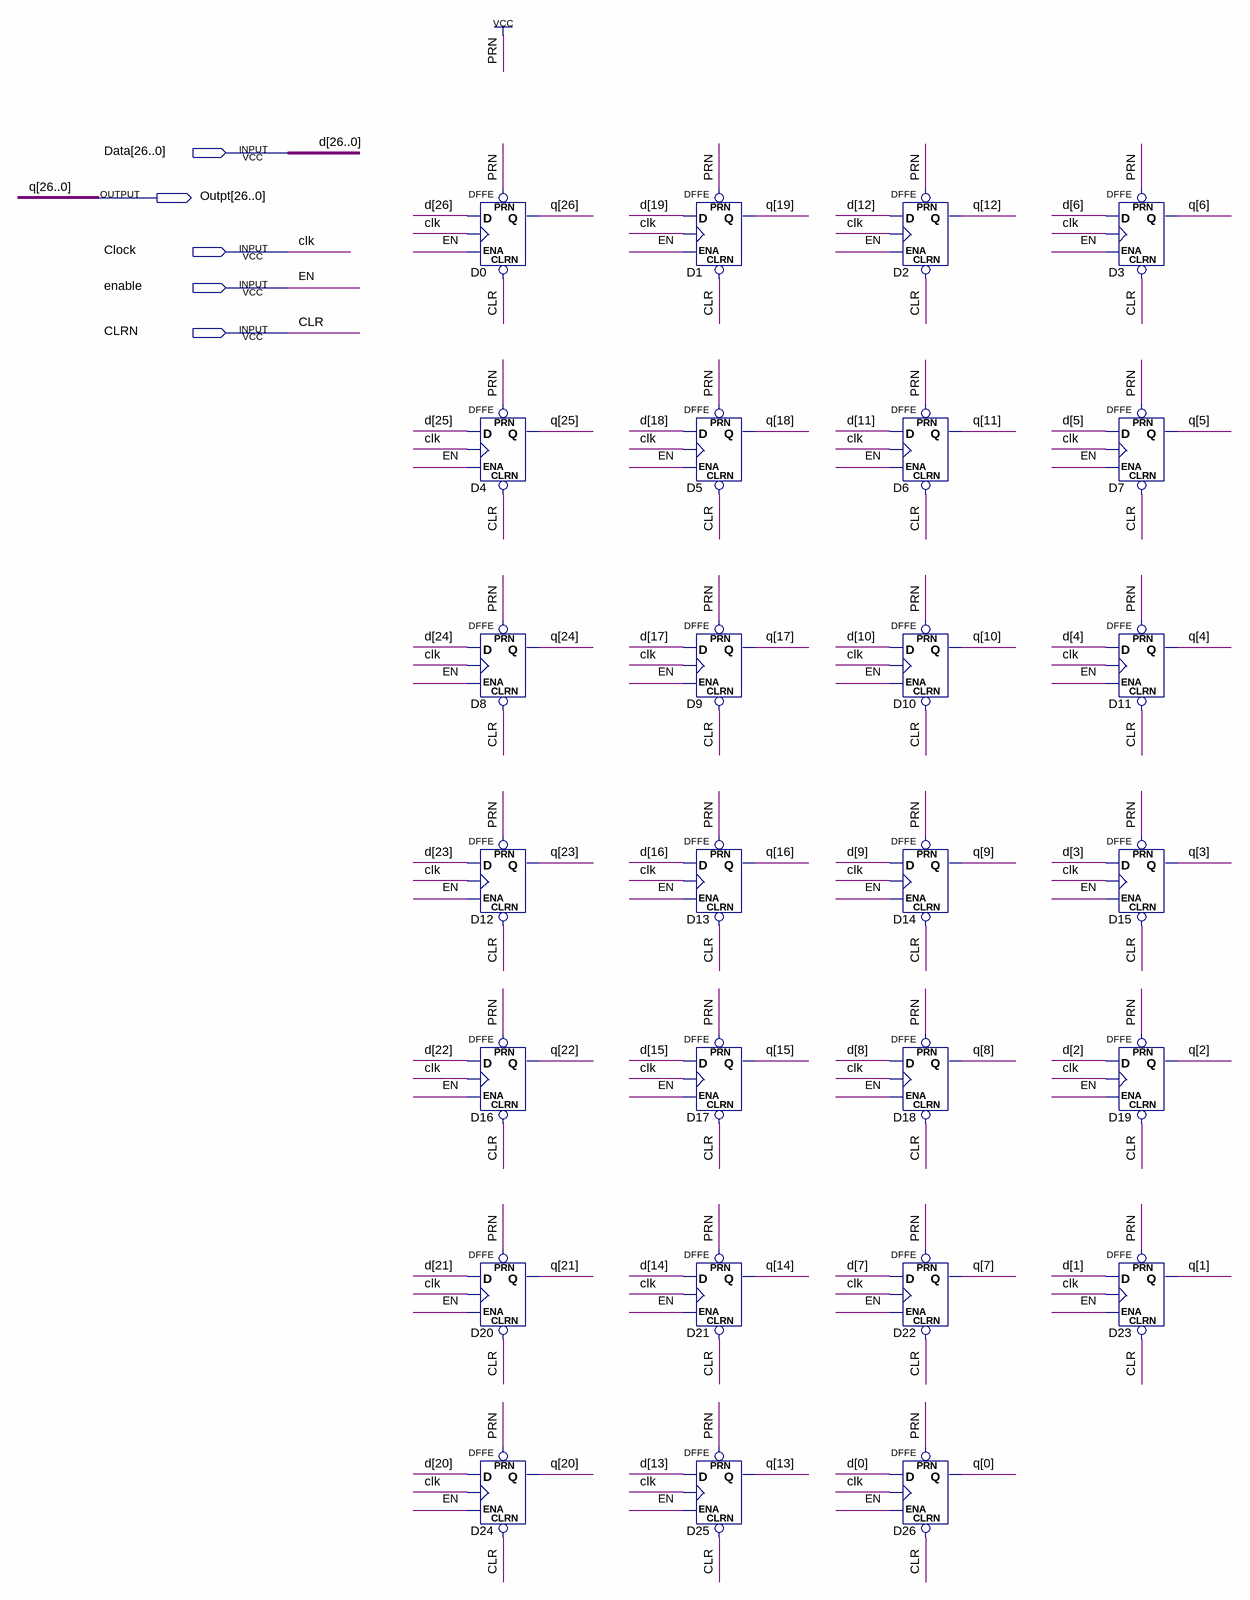
[diagram p0: schematic sheet]
// Quartus schematic twentysixbitreg.bdf as structural Verilog: 27 symbols, 5 pins
module twentysixbitreg (
  input  [26:0] Data,
  input  Clock,
  input  enable,
  input  CLRN,
  output [26:0] Outpt
);

  DFFE D0 (.PRN(1'b1), .CLRN(CLRN), .D(Data[26]), .CLK(Clock), .ENA(enable), .Q(Outpt[26]));
  DFFE D4 (.PRN(1'b1), .CLRN(CLRN), .D(Data[25]), .CLK(Clock), .ENA(enable), .Q(Outpt[25]));
  DFFE D8 (.PRN(1'b1), .CLRN(CLRN), .D(Data[24]), .CLK(Clock), .ENA(enable), .Q(Outpt[24]));
  DFFE D12 (.PRN(1'b1), .CLRN(CLRN), .D(Data[23]), .CLK(Clock), .ENA(enable), .Q(Outpt[23]));
  DFFE D16 (.PRN(1'b1), .CLRN(CLRN), .D(Data[22]), .CLK(Clock), .ENA(enable), .Q(Outpt[22]));
  DFFE D20 (.PRN(1'b1), .CLRN(CLRN), .D(Data[21]), .CLK(Clock), .ENA(enable), .Q(Outpt[21]));
  DFFE D24 (.PRN(1'b1), .CLRN(CLRN), .D(Data[20]), .CLK(Clock), .ENA(enable), .Q(Outpt[20]));
  DFFE D1 (.PRN(1'b1), .CLRN(CLRN), .D(Data[19]), .CLK(Clock), .ENA(enable), .Q(Outpt[19]));
  DFFE D5 (.PRN(1'b1), .CLRN(CLRN), .D(Data[18]), .CLK(Clock), .ENA(enable), .Q(Outpt[18]));
  DFFE D9 (.PRN(1'b1), .CLRN(CLRN), .D(Data[17]), .CLK(Clock), .ENA(enable), .Q(Outpt[17]));
  DFFE D13 (.PRN(1'b1), .CLRN(CLRN), .D(Data[16]), .CLK(Clock), .ENA(enable), .Q(Outpt[16]));
  DFFE D17 (.PRN(1'b1), .CLRN(CLRN), .D(Data[15]), .CLK(Clock), .ENA(enable), .Q(Outpt[15]));
  DFFE D21 (.PRN(1'b1), .CLRN(CLRN), .D(Data[14]), .CLK(Clock), .ENA(enable), .Q(Outpt[14]));
  DFFE D25 (.PRN(1'b1), .CLRN(CLRN), .D(Data[13]), .CLK(Clock), .ENA(enable), .Q(Outpt[13]));
  DFFE D2 (.PRN(1'b1), .CLRN(CLRN), .D(Data[12]), .CLK(Clock), .ENA(enable), .Q(Outpt[12]));
  DFFE D6 (.PRN(1'b1), .CLRN(CLRN), .D(Data[11]), .CLK(Clock), .ENA(enable), .Q(Outpt[11]));
  DFFE D10 (.PRN(1'b1), .CLRN(CLRN), .D(Data[10]), .CLK(Clock), .ENA(enable), .Q(Outpt[10]));
  DFFE D14 (.PRN(1'b1), .CLRN(CLRN), .D(Data[9]), .CLK(Clock), .ENA(enable), .Q(Outpt[9]));
  DFFE D18 (.PRN(1'b1), .CLRN(CLRN), .D(Data[8]), .CLK(Clock), .ENA(enable), .Q(Outpt[8]));
  DFFE D22 (.PRN(1'b1), .CLRN(CLRN), .D(Data[7]), .CLK(Clock), .ENA(enable), .Q(Outpt[7]));
  DFFE D26 (.PRN(1'b1), .CLRN(CLRN), .D(Data[0]), .CLK(Clock), .ENA(enable), .Q(Outpt[0]));
  DFFE D3 (.PRN(1'b1), .CLRN(CLRN), .D(Data[6]), .CLK(Clock), .ENA(enable), .Q(Outpt[6]));
  DFFE D7 (.PRN(1'b1), .CLRN(CLRN), .D(Data[5]), .CLK(Clock), .ENA(enable), .Q(Outpt[5]));
  DFFE D11 (.PRN(1'b1), .CLRN(CLRN), .D(Data[4]), .CLK(Clock), .ENA(enable), .Q(Outpt[4]));
  DFFE D15 (.PRN(1'b1), .CLRN(CLRN), .D(Data[3]), .CLK(Clock), .ENA(enable), .Q(Outpt[3]));
  DFFE D19 (.PRN(1'b1), .CLRN(CLRN), .D(Data[2]), .CLK(Clock), .ENA(enable), .Q(Outpt[2]));
  DFFE D23 (.PRN(1'b1), .CLRN(CLRN), .D(Data[1]), .CLK(Clock), .ENA(enable), .Q(Outpt[1]));

  // Other names for the same wires on the sheet: clk = Clock; CLR = CLRN; d[26:0] = Data; EN = enable;
  //   q[26:0] = Outpt
endmodule
